# EAGLE design 1wire_connection_board (EAGLE 7.5.0)
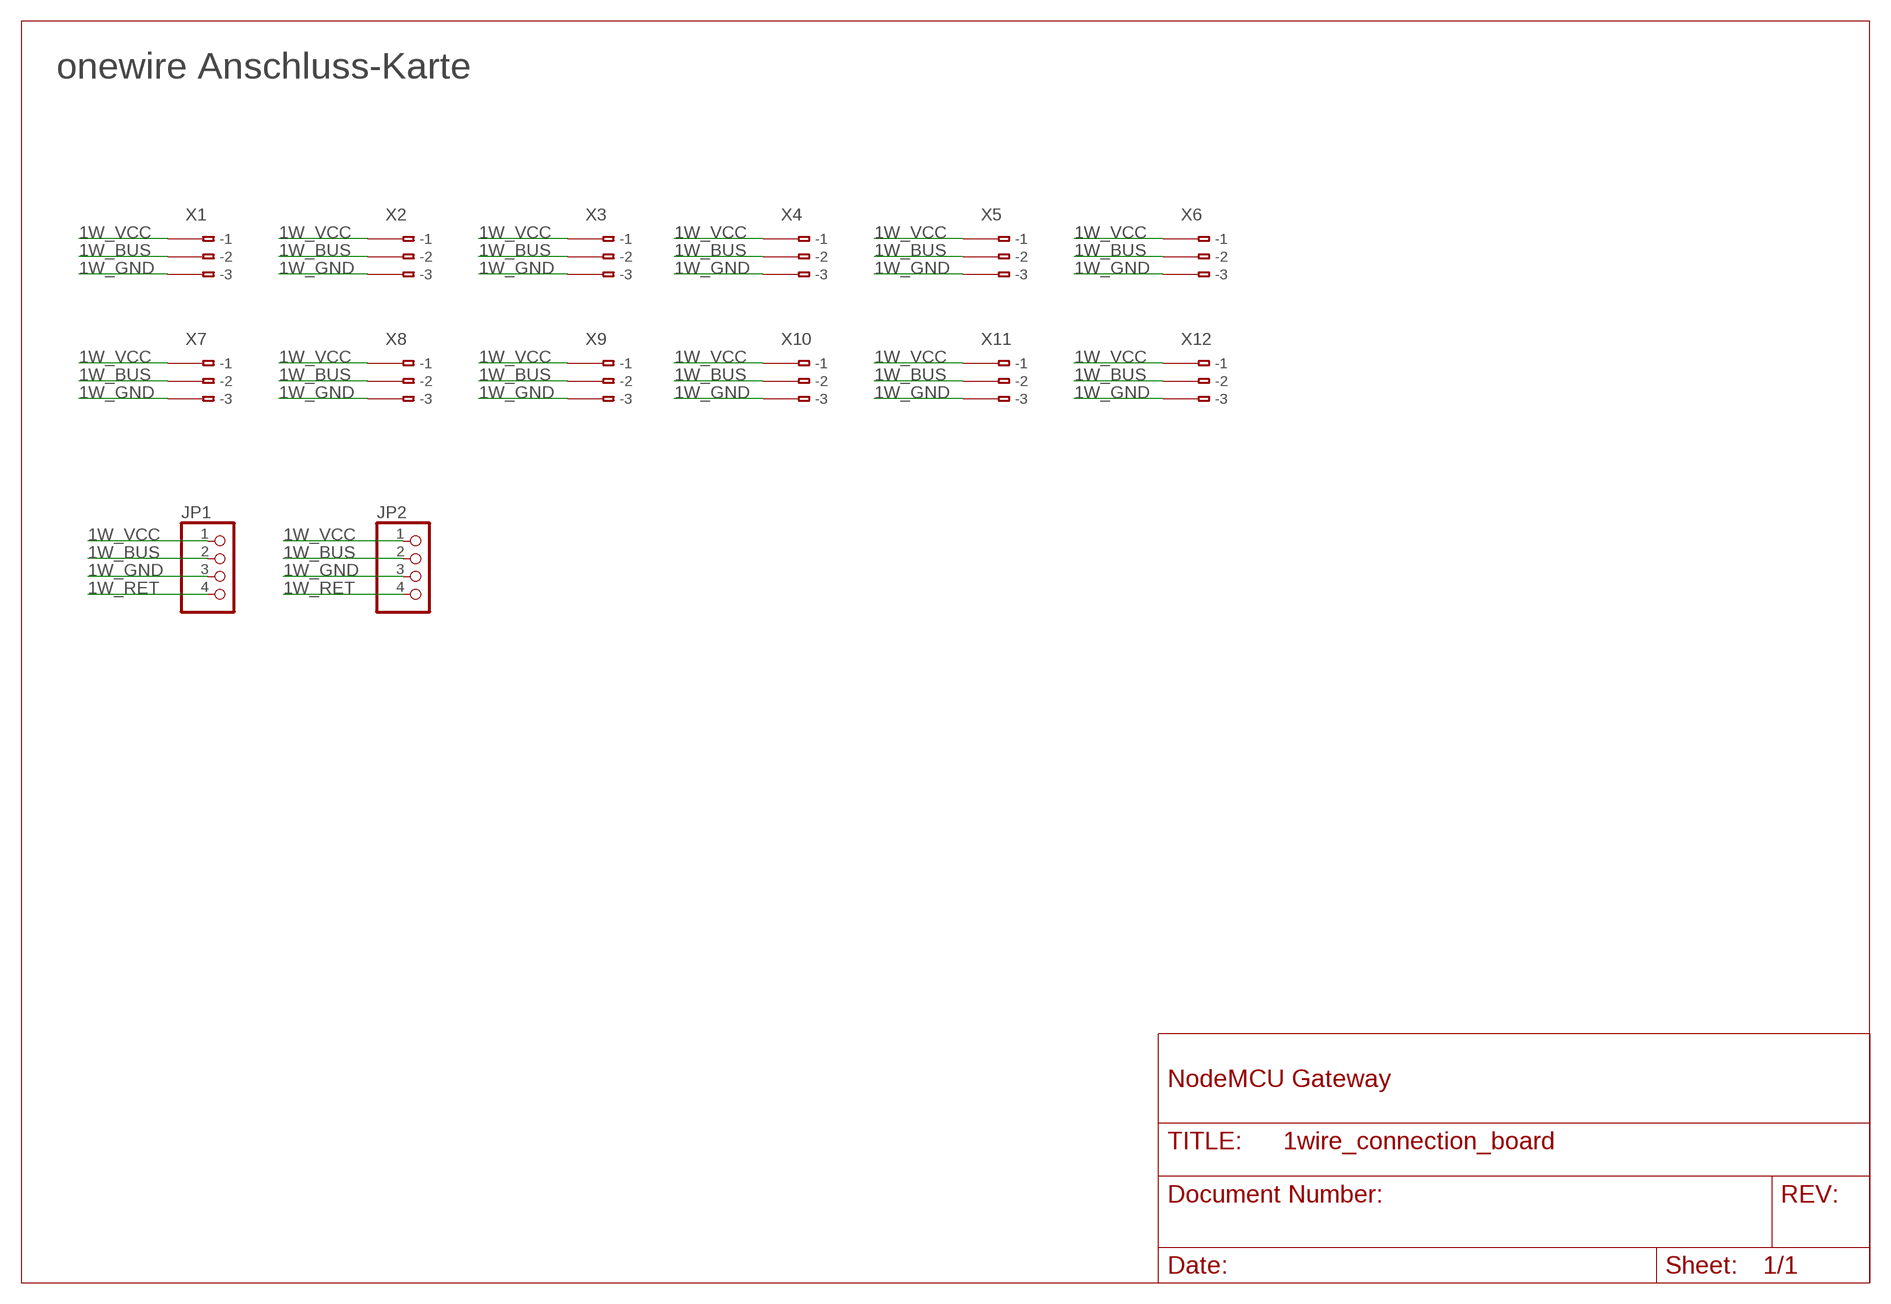
[diagram p0: schematic, sheet 1]

## Parts
JP1  PINHD-1X4_S  [1X04]
JP2  PINHD-1X4_S  [1X04]
X1  CON_350-103  [CON_350-103]
X2  CON_350-103OHNE_RAND  [CON_350-103_O]
X3  CON_350-103OHNE_RAND  [CON_350-103_O]
X4  CON_350-103OHNE_RAND  [CON_350-103_O]
X5  CON_350-103OHNE_RAND  [CON_350-103_O]
X6  CON_350-103OHNE_RAND  [CON_350-103_O]
X7  CON_350-103  [CON_350-103]
X8  CON_350-103OHNE_RAND  [CON_350-103_O]
X9  CON_350-103OHNE_RAND  [CON_350-103_O]
X10  CON_350-103OHNE_RAND  [CON_350-103_O]
X11  CON_350-103OHNE_RAND  [CON_350-103_O]
X12  CON_350-103OHNE_RAND  [CON_350-103_O]

## Nets
1W_BUS: JP1.2 JP2.2 X1.B2(B-2) X2.B2(B-2) X3.B2(B-2) X4.B2(B-2) X5.B2(B-2) X6.B2(B-2) X7.B2(B-2) X8.B2(B-2) X9.B2(B-2) X10.B2(B-2) X11.B2(B-2) X12.B2(B-2)
1W_GND: JP1.3 JP2.3 X1.B3(B-3) X2.B3(B-3) X3.B3(B-3) X4.B3(B-3) X5.B3(B-3) X6.B3(B-3) X7.B3(B-3) X8.B3(B-3) X9.B3(B-3) X10.B3(B-3) X11.B3(B-3) X12.B3(B-3)
1W_RET: JP1.4 JP2.4
1W_VCC: JP1.1 JP2.1 X1.B1(B-1) X2.B1(B-1) X3.B1(B-1) X4.B1(B-1) X5.B1(B-1) X6.B1(B-1) X7.B1(B-1) X8.B1(B-1) X9.B1(B-1) X10.B1(B-1) X11.B1(B-1) X12.B1(B-1)
Unconnected: X1.A1(-1) X1.A2(-2) X1.A3(-3) X2.A1(-1) X2.A2(-2) X2.A3(-3) X3.A1(-1) X3.A2(-2) X3.A3(-3) X4.A1(-1) X4.A2(-2) X4.A3(-3) X5.A1(-1) X5.A2(-2) X5.A3(-3) X6.A1(-1) X6.A2(-2) X6.A3(-3) X7.A1(-1) X7.A2(-2) X7.A3(-3) X8.A1(-1) X8.A2(-2) X8.A3(-3) X9.A1(-1) X9.A2(-2) X9.A3(-3) X10.A1(-1) X10.A2(-2) X10.A3(-3) X11.A1(-1) X11.A2(-2) X11.A3(-3) X12.A1(-1) X12.A2(-2) X12.A3(-3)

## Notes on the sheet
- onewire Anschluss-Karte
- NodeMCU Gateway

## Library data of the parts
JP1 JP2 = my:PINHD-1X4_S: PIN HEADER
X1 X7 = my:CON_350-103: KF250-3.5 3p; MPN: 233-103; OC_FARNELL: unknown; OC_NEWARK: 28K9045
X2-X6 X8-X12 = my:CON_350-103: KF250-3.5 3p

## Board
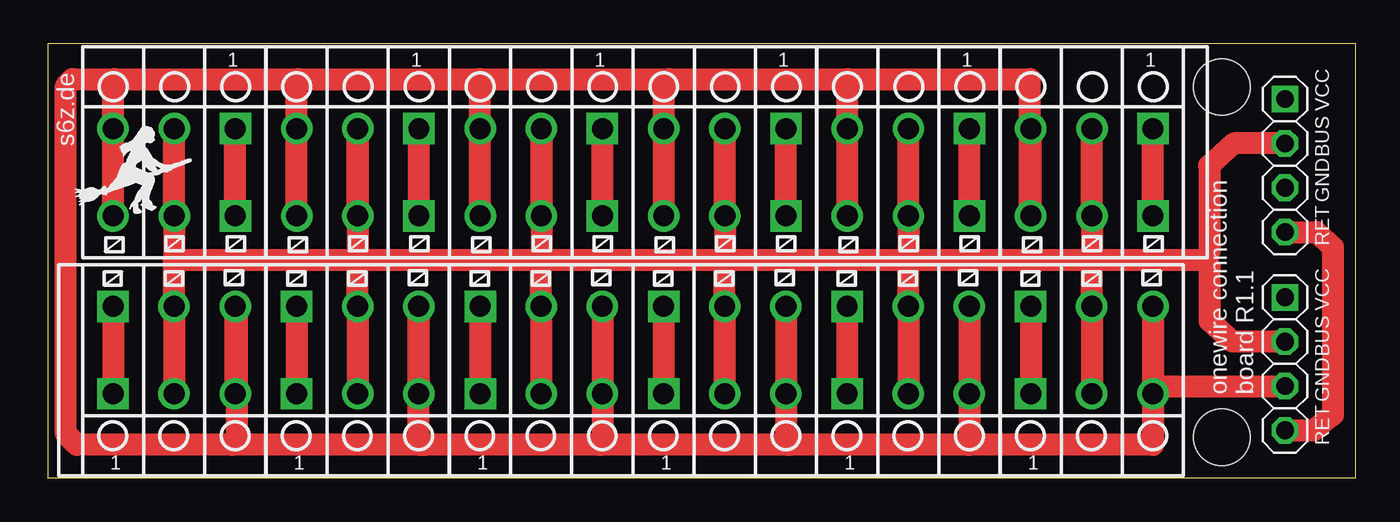
[diagram p1: board, top side]
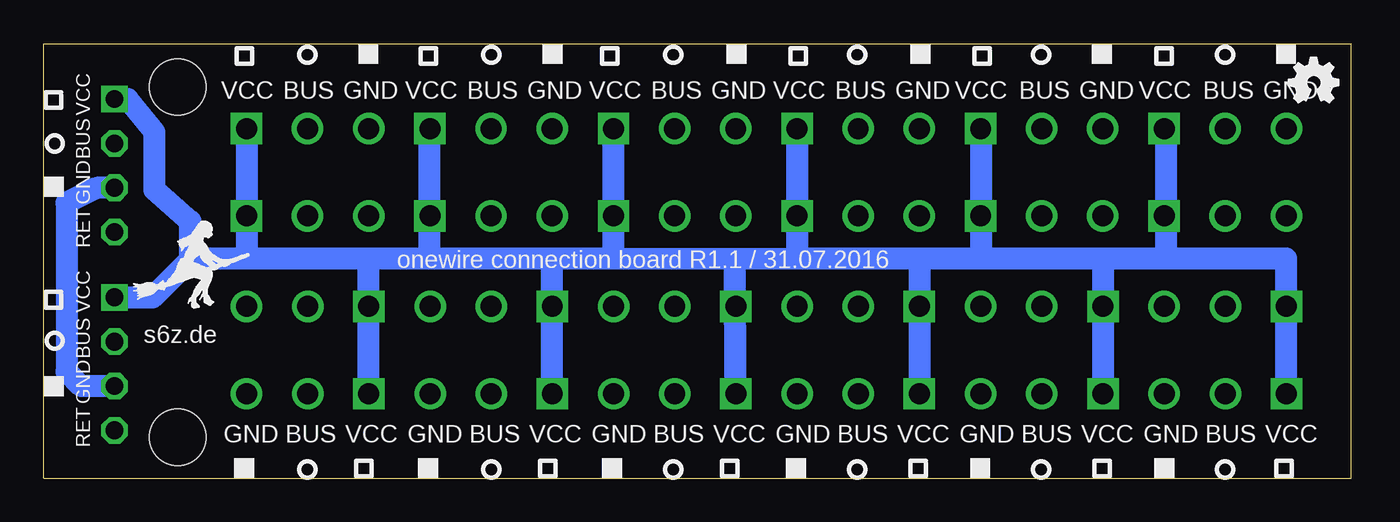
[diagram p2: board, bottom side, seen from below]

Size 74.93 x 24.89 mm. Coordinates in mm from the lower left corner, seen from the top.
Outline: 0,0 0,24.89 74.93,24.89 74.93,0 0,0
Copper layers (1*16): Top 0.035mm / dielectric 1.5mm / Bottom 0.035mm
Design rules "ITEADstudio_DRC *": minimum track width 16mil, minimum drill 12mil, track to track 6mil, track to pad 10mil, pad to pad 6mil, via to via 6mil, smd to smd 0mil, copper to edge 10mil, drill to drill 10mil, minimum pad ring 10mil, minimum via ring 6mil, stop-mask expansion 2mil, vias tented up to drill 100mil, thermal gap 16mil
Holes 3.2 mm at 67.25,2.35 67.25,22.42

### Footprints (pad centres in the part's own frame; a part is rotated, then mirrored left to right if it is on the bottom)
1X04 = drill 1.016 square: 1 -3.81,0 | drill 1.016 octagon: 2 -1.27,0; 3 1.27,0; 4 3.81,0
CON_350-103 = drill 1.2 square: A1 -2.5,2.5; B1 -2.5,-2.5 | drill 1.2: A2 1,2.5; A3 4.5,2.5; B2 1,-2.5; B3 4.5,-2.5
CON_350-103_O = drill 1.2 square: A1 -2.5,2.5; B1 -2.5,-2.5 | drill 1.2: A2 1,2.5; A3 4.5,2.5; B2 1,-2.5; B3 4.5,-2.5

### Placement (x,y rotation side)
JP1  70.87,17.91 270 top
JP2  70.87,6.55 270 top
U$1  [OSHW_FILLX100_NOTEXT]  3.57,21.53 0 bottom
X1  6.22,7.34 0 top
X2  16.74,7.34 0 top
X3  27.25,7.34 0 top
X4  37.77,7.34 0 top
X5  48.29,7.34 0 top
X6  58.8,7.34 0 top
X7  60.81,17.53 180 top
X8  50.29,17.53 180 top
X9  39.78,17.53 180 top
X10  29.26,17.53 180 top
X11  18.75,17.53 180 top
X12  8.23,17.53 180 top

### Tracks (layer width: path | path; a pad name or v marks a point on that pad's centre or on a via)
1W_BUS
  Top 1.27: 7.37,12.52 7.24,12.52 7.22,12.51 7.22,9.84 | 7.37,12.52 17.65,12.52 | 17.65,12.52 17.91,12.52 | 17.91,12.52 28.19,12.52 | 28.19,12.52 28.45,12.52 | 28.45,12.52 38.86,12.52 | 38.86,12.52 38.99,12.52 | 38.99,12.52 49.4,12.52 | 49.4,12.52 59.82,12.52 | 59.82,12.52 66.27,12.52 | JP1.2 67.95,19.18 66.52,17.91 66.52,12.93 66.27,12.52 | JP2.2 67.87,7.82 66.55,9.02 66.55,12.12 66.27,12.52 | X11.B2 17.75,12.61 17.65,12.52 | 7.23,15.03 7.23,12.66 7.37,12.52 | 17.74,9.84 17.74,12.35 17.91,12.52 | 28.25,9.84 28.25,12.33 28.45,12.52 | X10.B2 28.26,12.59 28.19,12.52 | 38.78,15.03 38.78,12.74 38.99,12.52 | 38.77,9.84 38.77,12.43 38.86,12.52 | 49.29,15.03 49.29,12.63 49.4,12.52 | 49.28,9.84 49.28,12.41 49.4,12.52 | 59.81,15.03 59.81,12.53 59.82,12.52 | 59.8,9.84 59.8,12.51 59.82,12.52
1W_GND
  Top 1.27: 52.76,1.91 63.3,1.91 X6.B3 63.75,5.28 JP2.3 | 52.76,1.91 42.44,1.91 | 42.44,1.91 31.65,1.91 | 31.65,1.91 21.57,1.91 | 21.57,1.91 10.54,1.91 | 10.54,1.91 1.65,1.91 1.02,2.54 1.02,22.48 1.4,22.86 3.81,22.86 | 3.81,22.86 14.35,22.86 | 14.35,22.86 24.77,22.86 | 24.77,22.86 35.56,22.86 | 35.56,22.86 45.85,22.86 | 45.85,22.86 56.26,22.86 56.26,15.49 56.31,15.45 56.31,15.03 | X12.B3 3.73,22.78 3.81,22.86 | 14.25,15.03 14.25,22.75 14.35,22.86 | 24.76,15.03 24.76,22.86 24.77,22.86 | 35.28,15.03 35.28,22.58 35.56,22.86 | 45.79,15.03 45.79,22.81 45.85,22.86 | 10.72,9.84 10.73,9.84 10.79,9.65 10.79,2.29 10.54,1.91 | 21.24,9.84 21.53,9.84 21.21,9.78 21.21,1.93 21.57,1.91 | 31.75,9.84 31.75,2.01 31.65,1.91 | 42.27,9.84 42.27,2.08 42.44,1.91 | 52.78,9.84 52.78,1.94 52.76,1.91
  Bottom 1.27: JP1.3 71.88,16.64 73.61,15.77 73.61,6.12 72.77,5.28 JP2.3
1W_RET
  Top 1.27: JP1.4 72.67,14.1 73.61,13.23 73.61,3.63 72.49,2.74 JP2.4
1W_VCC
  Bottom 0.406: 3.76,5 X1.B1 | 14.25,5 X2.B1 | 21.21,19.81 X11.B1 | 24.74,5 X3.B1 | 31.75,19.81 X10.B1 | 35.31,5 X4.B1 | 42.29,19.81 X9.B1 | 45.82,5 X5.B1 | 52.81,19.81 X8.B1 | 56.31,5.74 X6.B1
  Bottom 1.27: 10.62,12.57 3.76,12.57 3.76,5 | 10.62,12.57 14.25,12.57 | 14.25,12.57 21.21,12.57 | 21.21,12.57 24.74,12.57 | 24.74,12.57 31.75,12.57 | 31.75,12.57 35.36,12.55 | 35.36,12.55 42.29,12.57 | 42.29,12.57 45.82,12.57 | 45.82,12.57 52.81,12.57 | 52.81,12.57 56.34,12.57 | 56.34,12.57 66.09,12.57 | 66.09,12.57 66.47,12.57 | 66.47,12.57 66.52,12.62 66.52,14.73 68.58,16.51 68.58,19.81 70.1,21.72 JP1.1 | JP2.1 68.68,10.36 66.47,12.57 | X7.B1 63.29,12.58 65.95,12.58 66.09,12.57 | 14.25,12.57 14.25,5 | 21.21,12.57 21.21,19.81 | 24.74,12.57 24.74,5 | 31.75,12.57 31.75,19.81 | 35.36,12.55 35.31,5 | 42.29,12.57 42.29,19.81 | 45.82,12.57 45.82,5 | 52.81,12.57 52.81,19.81 | 56.34,12.57 56.34,4.88 X6.B1 | 10.62,12.57 10.62,19.91 X12.B1

### Text on the board
tPlace: VCC | s6z.de | BUS | GND | RET | VCC | BUS | onewire connection / board R1.1 | GND | RET
bPlace: GND | BUS | VCC | GND | BUS | VCC | GND | BUS | VCC | GND | BUS | VCC | GND | BUS | VCC | GND | BUS | VCC | VCC | BUS | GND | RET | onewire connection board R1.1 / 31.07.2016 | VCC | s6z.de | BUS | GND | VCC | BUS | GND | VCC | BUS | GND | VCC | BUS | GND | VCC | BUS | GND | VCC | BUS | GND | VCC | BUS | GND | RET